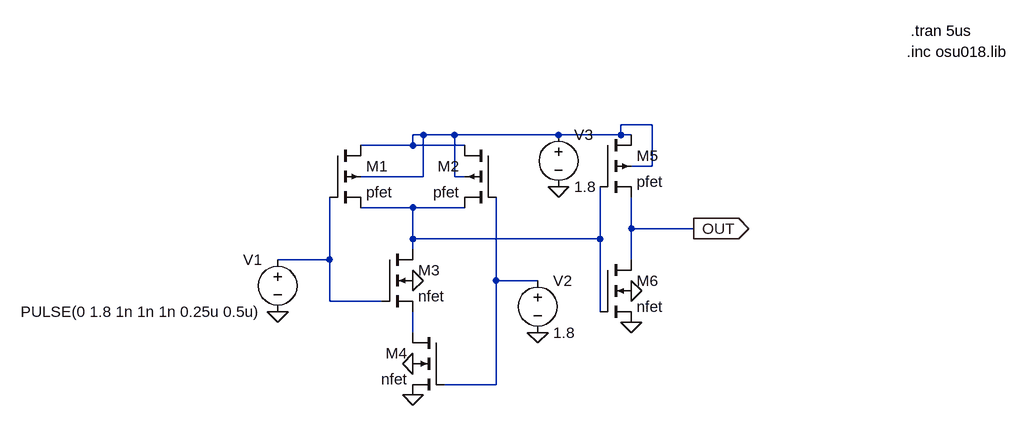
[diagram p0: schematic AND.asc]
AND.asc, the LTspice schematic file:
Version 4
SHEET 1 1156 680
WIRE 592 16 544 16
WIRE 240 32 224 32
WIRE 288 32 240 32
WIRE 448 32 288 32
WIRE 544 32 544 16
WIRE 544 32 448 32
WIRE 560 32 544 32
WIRE 224 48 224 32
WIRE 224 48 144 48
WIRE 304 48 224 48
WIRE 592 80 592 16
WIRE 592 80 560 80
WIRE 240 96 240 32
WIRE 240 96 144 96
WIRE 288 96 288 32
WIRE 304 96 288 96
WIRE 224 144 144 144
WIRE 304 144 224 144
WIRE 560 176 560 128
WIRE 656 176 560 176
WIRE 224 192 224 144
WIRE 512 192 512 112
WIRE 512 192 224 192
WIRE 224 208 224 192
WIRE 96 224 96 128
WIRE 96 224 16 224
WIRE 560 224 560 176
WIRE 352 256 352 128
WIRE 416 256 352 256
WIRE 96 288 96 224
WIRE 176 288 96 288
WIRE 512 304 512 192
WIRE 224 336 224 304
WIRE 352 416 352 256
WIRE 352 416 272 416
FLAG 224 256 0
FLAG 560 272 0
FLAG 560 320 0
FLAG 656 176 OUT
IOPIN 656 176 Out
FLAG 448 112 0
FLAG 16 304 0
FLAG 416 336 0
FLAG 224 384 0
FLAG 224 432 0
SYMBOL pmos4 96 48 R0
SYMATTR InstName M1
SYMATTR Value pfet
SYMATTR Value2 l=0.2u w=0.24u
SYMBOL pmos4 352 48 M0
SYMATTR InstName M2
SYMATTR Value pfet
SYMATTR Value2 l=0.2u w=0.24u
SYMBOL nmos4 176 208 R0
SYMATTR InstName M3
SYMATTR Value nfet
SYMATTR Value2 l=0.2u w=0.24u
SYMBOL pmos4 512 32 R0
SYMATTR InstName M5
SYMATTR Value pfet
SYMATTR Value2 l=0.2u w=0.24u
SYMBOL nmos4 512 224 R0
SYMATTR InstName M6
SYMATTR Value nfet
SYMATTR Value2 l=0.2u w=0.24u
SYMBOL voltage 16 208 M0
WINDOW 123 0 0 Left 0
WINDOW 39 0 0 Left 0
SYMATTR InstName V1
SYMATTR Value PULSE(0 1.8 1n 1n 1n 0.25u 0.5u)
SYMBOL voltage 416 240 R0
WINDOW 123 0 0 Left 0
WINDOW 39 0 0 Left 0
SYMATTR InstName V2
SYMATTR Value 1.8
SYMBOL voltage 448 16 R0
WINDOW 123 0 0 Left 0
WINDOW 39 0 0 Left 0
SYMATTR InstName V3
SYMATTR Value 1.8
SYMBOL nmos4 272 336 M0
SYMATTR InstName M4
SYMATTR Value nfet
SYMATTR Value2 l=0.2u w=0.24u
TEXT 990 -128 Left 2 !.tran 5us
TEXT 984 -96 Left 2 !.inc osu018.lib

The netlist it stands for:
* AND.asc
M1 N001 N003 N002 N001 pfet l=0.2u w=0.24u
M2 N001 N004 N002 N001 pfet l=0.2u w=0.24u
M3 N002 N003 N005 0 nfet l=0.2u w=0.24u
M5 N001 N002 OUT N001 pfet l=0.2u w=0.24u
M6 OUT N002 0 0 nfet l=0.2u w=0.24u
V1 N003 0 PULSE(0 1.8 1n 1n 1n 0.25u 0.5u)
V2 N004 0 1.8
V3 N001 0 1.8
M4 N005 N004 0 0 nfet l=0.2u w=0.24u
.model NMOS NMOS
.model PMOS PMOS
.lib standard.mos
.tran 5us
.inc osu018.lib
.backanno
.end